# EAGLE schematic nixie_clock (EAGLE 7.5.0)

## Sheet 1 of 2

## Sheet 2 of 2
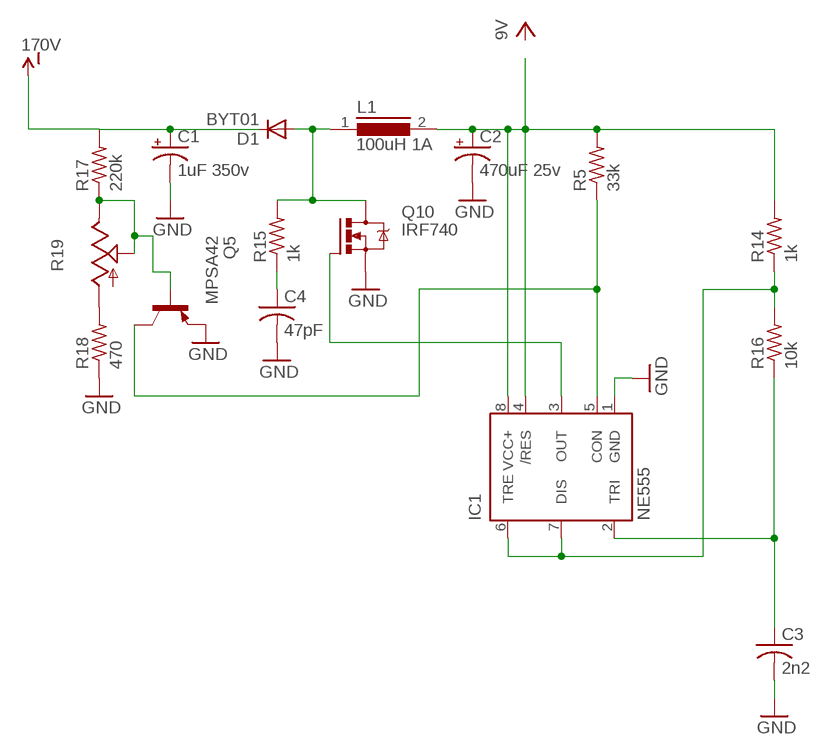
[diagram p0: schematic, sheet 2]

### Parts
C1  1uF 350v  CPOL-USE2.5-7  [E2,5-7]
C2  470uF 25v  CPOL-USE5-10.5  [E5-10,5]
C3  2n2  C-US050-024X044  [C050-024X044]
C4  47pF  C-US075-032X103  [C075-032X103]
D1  BYT01  [F126-10]
IC1  NE555  [DIL-08]
L1  100uH 1A  MESC26  [MESC26]
Q5  MPSA42  2N4126  [TO92-CBE]
Q10  IRF740  [TO220BV]
R5  33k  R-US_0207/2V  [0207/2V]
R14  1k  R-US_0207/2V  [0207/2V]
R15  1k  R-US_0207/2V  [0207/2V]
R16  10k  R-US_0207/2V  [0207/2V]
R17  220k  R-US_0207/2V  [0207/2V]
R18  470  R-US_0207/2V  [0207/2V]
R19  TRIM_US-B25P  [B25P]

### Nets
GND: C1.- C2.- C3.2 C4.2 IC1.1(GND) Q5.E Q10.S R18.1
N$1: C2.+ IC1.4(/RES) IC1.8(VCC+) L1.2 R5.2 R14.2
N$8: C4.1 R15.1
N$45: D1.A L1.1 Q10.D R15.2
N$46: Q5.B R17.1 R19.E R19.S
N$47: R18.2 R19.A
N$50: IC1.6(TRE) IC1.7(DIS) R14.1 R16.2
N$53: IC1.3(OUT) Q10.G
N$54: IC1.5(CON) Q5.C R5.1
N$56: C3.1 IC1.2(TRI) R16.1
VCC-ISO: C1.+ D1.C R17.2 ; supply symbol labelled 170V

## Library data of the parts
C1 C2 = rcl:CPOL-US: POLARIZED CAPACITOR, American symbol
C3 C4 = rcl:C-US: CAPACITOR, American symbol
D1 = diode:BYT01: DIODE ultra fast
IC1 = st-microelectronics:NE555: General purpose bipolar Timer
L1 = inductors:MESC26: INDUCTOR
Q5 = transistor-pnp:2N4126*: PNP Transistror
Q10 = transistor-power:IRF740: N-CHANNEL MOS FET
R5 R14-R18 = rcl:R-US_: RESISTOR, American symbol
R19 = pot:TRIM_US-: POTENTIOMETER